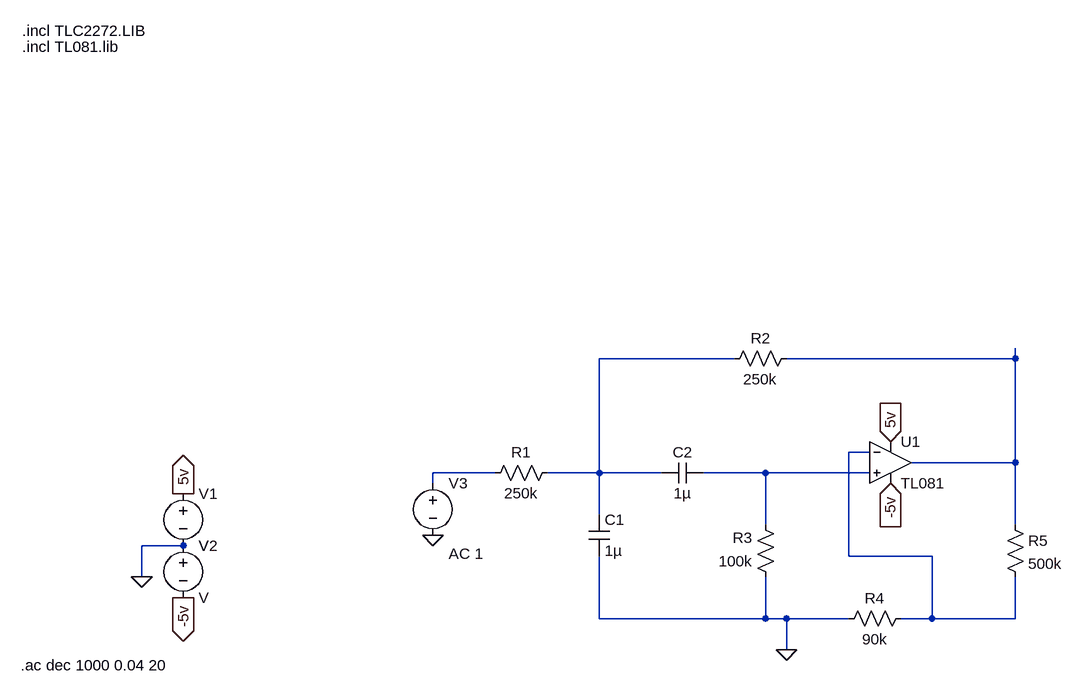
[diagram p0: schematic Draft2.asc]
Draft2.asc, the LTspice schematic file:
Version 4
SHEET 1 1528 680
WIRE 784 -144 576 -144
WIRE 1216 -144 1216 -160
WIRE 1216 -144 864 -144
WIRE 992 0 960 0
WIRE 1216 16 1216 -144
WIRE 1216 16 1056 16
WIRE 416 32 320 32
WIRE 576 32 576 -144
WIRE 576 32 496 32
WIRE 672 32 576 32
WIRE 832 32 736 32
WIRE 992 32 832 32
WIRE 320 48 320 32
WIRE 576 96 576 32
WIRE 832 112 832 32
WIRE 1216 112 1216 16
WIRE -64 144 -128 144
WIRE 960 160 960 0
WIRE 1088 160 960 160
WIRE -128 192 -128 144
WIRE 576 256 576 160
WIRE 832 256 832 192
WIRE 832 256 576 256
WIRE 864 256 832 256
WIRE 960 256 864 256
WIRE 1088 256 1088 160
WIRE 1088 256 1040 256
WIRE 1216 256 1216 192
WIRE 1216 256 1088 256
WIRE 864 304 864 256
FLAG -64 224 -5v
IOPIN -64 224 Out
FLAG -64 64 5v
IOPIN -64 64 Out
FLAG -128 192 0
FLAG 864 304 0
FLAG 1024 -16 5v
IOPIN 1024 -16 In
FLAG 1024 48 -5v
IOPIN 1024 48 In
FLAG 320 128 0
SYMBOL voltage -64 48 R0
SYMATTR InstName V1
SYMBOL voltage -64 128 R0
SYMATTR InstName V2
SYMBOL res 512 16 R90
WINDOW 0 0 56 VBottom 2
WINDOW 3 32 56 VTop 2
SYMATTR InstName R1
SYMATTR Value 250k
SYMBOL res 880 -160 R90
WINDOW 0 0 56 VBottom 2
WINDOW 3 32 56 VTop 2
SYMATTR InstName R2
SYMATTR Value 250k
SYMBOL res 848 208 R180
WINDOW 0 36 76 Left 2
WINDOW 3 36 40 Left 2
SYMATTR InstName R3
SYMATTR Value 100k
SYMBOL res 944 272 R270
WINDOW 0 32 56 VTop 2
WINDOW 3 0 56 VBottom 2
SYMATTR InstName R4
SYMATTR Value 90k
SYMBOL Opamps\\opamp2 1024 -48 R0
SYMATTR InstName U1
SYMATTR Value TL081
SYMBOL cap 560 96 R0
SYMATTR InstName C1
SYMATTR Value 1µ
SYMBOL cap 736 16 R90
WINDOW 0 0 32 VBottom 2
WINDOW 3 32 32 VTop 2
SYMATTR InstName C2
SYMATTR Value 1µ
SYMBOL voltage 320 32 R0
WINDOW 123 24 124 Left 2
WINDOW 39 0 0 Left 0
SYMATTR InstName V3
SYMATTR Value ""
SYMATTR Value2 AC 1
SYMBOL res 1200 96 R0
SYMATTR InstName R5
SYMATTR Value 500k
TEXT -312 -648 Left 2 !.incl TLC2272.LIB
TEXT -312 -624 Left 2 !.incl TL081.lib
TEXT -314 328 Left 2 !.ac dec 1000 0.04 20

The netlist it stands for:
* Draft2.asc
V1 5v 0 V
V2 0 -5v V
R1 N001 N004 250k
R2 N002 N001 250k
R3 0 N005 100k
R4 0 N003 90k
XU1 N005 N003 5v -5v N002 TL081  ; pins In+ In- V+ V- OUT
C1 N001 0 1µ
C2 N005 N001 1µ
V3 N004 0 AC 1
R5 N002 N003 500k
.incl TLC2272.LIB
.incl TL081.lib
.ac dec 1000 0.04 20
.backanno
.end